# EAGLE design rc2014_8254 (EAGLE 7.6.0)
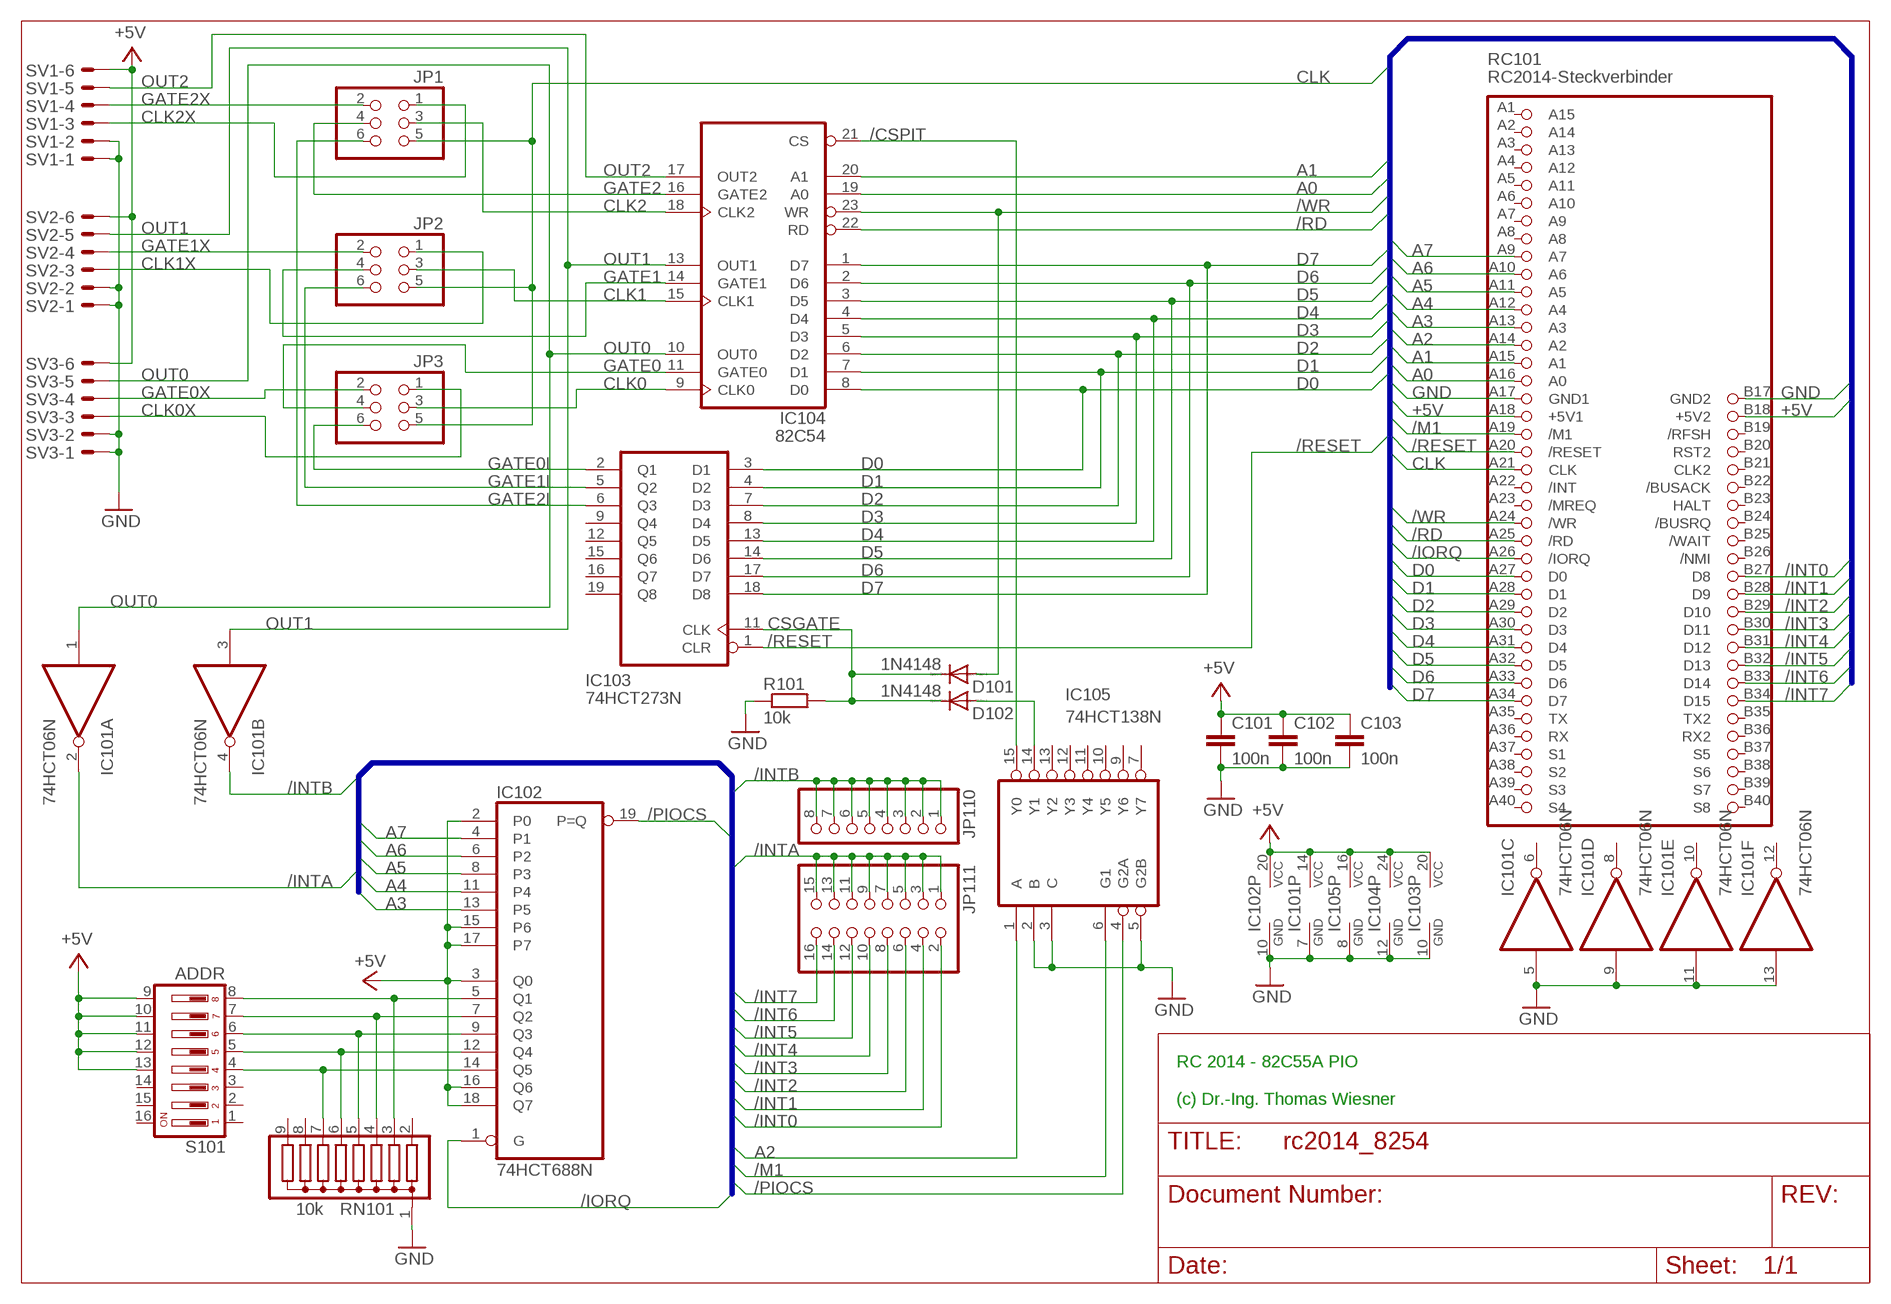
[diagram p0: schematic, sheet 1]

## Parts
C101  100n  C-EU025-025X050  [C025-025X050]
C102  100n  C-EU025-025X050  [C025-025X050]
C103  100n  C-EU025-025X050  [C025-025X050]
D101  1N4148  1N4148DO35-7  [DO35-7]
D102  1N4148  1N4148DO35-7  [DO35-7]
IC101  74HCT06N  74LS06N  [DIL14]
IC102  74HCT688N  [DIL20]
IC103  74HCT273N  [DIL20]
IC104  82C54  8253  [DIL24-6]
IC105  74HCT138N  [DIL16]
JP1  PINHD-2X3  [2X03]
JP2  PINHD-2X3  [2X03]
JP3  PINHD-2X3  [2X03]
JP110  PINHD-1X8  [1X08]
JP111  PINHD-2X8  [2X08]
R101  10k  R-EU_0207/10  [0207/10]
RC101  RC2014-Steckverbinder  RC2014STECKER  [RC2014-STECKER]
RN101  10k  G08R  [SIL9]
S101  ADDR  DS08  [DS-08]
SV1  ML6LE  [ML6L]
SV2  ML6LE  [ML6L]
SV3  ML6LE  [ML6L]

## Nets
+5V: C101.1 C102.1 C103.1 IC101.14(P:VCC) IC102.2(P0) IC102.3(Q0) IC102.15(P6) IC102.16(Q6) IC102.17(P7) IC102.18(Q7) IC102.20(VCC) IC103.20(VCC) IC104.24(VCC) IC105.16(VCC) RC101.A18(+5V1) RC101.B18(+5V2) S101.9 S101.10 S101.11 S101.12 S101.13 SV1.6 SV2.6 SV3.6
/CSPIT: IC104.21(CS) IC105.15(Y0)
/INT0: JP111.2 RC101.B27(D8)
/INT1: JP111.4 RC101.B28(D9)
/INT2: JP111.6 RC101.B29(D10)
/INT3: JP111.8 RC101.B30(D11)
/INT4: JP111.10 RC101.B31(D12)
/INT5: JP111.12 RC101.B32(D13)
/INT6: JP111.14 RC101.B33(D14)
/INT7: JP111.16 RC101.B34(D15)
/INTA: IC101.2(A:O) JP111.1 JP111.3 JP111.5 JP111.7 JP111.9 JP111.11 JP111.13 JP111.15
/INTB: IC101.4(B:O) JP110.1 JP110.2 JP110.3 JP110.4 JP110.5 JP110.6 JP110.7 JP110.8
/IORQ: IC102.1(G) RC101.A26(/IORQ)
/M1: IC105.6(G1) RC101.A19(/M1)
/PIOCS: IC102.19(P=Q) IC105.4(G2A)
/RD: IC104.22(RD) RC101.A25(/RD)
/RESET: IC103.1(CLR) RC101.A20(/RESET)
/WR: D101.A IC104.23(WR) RC101.A24(/WR)
A0: IC104.19(A0) RC101.A16(A0)
A1: IC104.20(A1) RC101.A15(A1)
A2: IC105.1(A) RC101.A14(A2)
A3: IC102.13(P5) RC101.A13(A3)
A4: IC102.11(P4) RC101.A12(A4)
A5: IC102.8(P3) RC101.A11(A5)
A6: IC102.6(P2) RC101.A10(A6)
A7: IC102.4(P1) RC101.A9(A7)
CLK: JP1.5 JP2.5 JP3.5 RC101.A21(CLK)
CLK0: IC104.9(CLK0) JP3.3
CLK0X: JP3.1 SV3.3
CLK1: IC104.15(CLK1) JP2.3
CLK1X: JP2.1 SV2.3
CLK2: IC104.18(CLK2) JP1.3
CLK2X: JP1.1 SV1.3
CSGATE: D101.C D102.C IC103.11(CLK) R101.2
D0: IC103.3(D1) IC104.8(D0) RC101.A27(D0)
D1: IC103.4(D2) IC104.7(D1) RC101.A28(D1)
D2: IC103.7(D3) IC104.6(D2) RC101.A29(D2)
D3: IC103.8(D4) IC104.5(D3) RC101.A30(D3)
D4: IC103.13(D5) IC104.4(D4) RC101.A31(D4)
D5: IC103.14(D6) IC104.3(D5) RC101.A32(D5)
D6: IC103.17(D7) IC104.2(D6) RC101.A33(D6)
D7: IC103.18(D8) IC104.1(D7) RC101.A34(D7)
GATE0: IC104.11(GATE0) JP3.4
GATE0I: IC103.2(Q1) JP3.6
GATE0X: JP3.2 SV3.4
GATE1: IC104.14(GATE1) JP2.4
GATE1I: IC103.5(Q2) JP2.6
GATE1X: JP2.2 SV2.4
GATE2: IC104.16(GATE2) JP1.4
GATE2I: IC103.6(Q3) JP1.6
GATE2X: JP1.2 SV1.4
GND: C101.2 C102.2 C103.2 IC101.5(C:I) IC101.7(P:GND) IC101.9(D:I) IC101.11(E:I) IC101.13(F:I) IC102.10(GND) IC103.10(GND) IC104.12(GND) IC105.2(B) IC105.3(C) IC105.5(G2B) IC105.8(GND) R101.1 RC101.A17(GND1) RC101.B17(GND2) RN101.1 SV1.1 SV1.2 SV2.1 SV2.2 SV3.1 SV3.2
N$1: D102.A IC105.14(Y1)
N$7: IC102.14(Q5) RN101.7 S101.4
N$8: IC102.12(Q4) RN101.6 S101.5
N$9: IC102.9(Q3) RN101.5 S101.6
N$10: IC102.7(Q2) RN101.4 S101.7
N$11: IC102.5(Q1) RN101.3 S101.8
OUT0: IC101.1(A:I) IC104.10(OUT0) SV3.5
OUT1: IC101.3(B:I) IC104.13(OUT1) SV2.5
OUT2: IC104.17(OUT2) SV1.5
Unconnected: IC101.6(C:O) IC101.8(D:O) IC101.10(E:O) IC101.12(F:O) IC103.9(Q4) IC103.12(Q5) IC103.15(Q6) IC103.16(Q7) IC103.19(Q8) IC105.7(Y7) IC105.9(Y6) IC105.10(Y5) IC105.11(Y4) IC105.12(Y3) IC105.13(Y2) RC101.A1(A15) RC101.A2(A14) RC101.A3(A13) RC101.A4(A12) RC101.A5(A11) RC101.A6(A10) RC101.A7(A9) RC101.A8 RC101.A22(/INT) RC101.A23(/MREQ) RC101.A35(TX) RC101.A36(RX) RC101.A37(S1) RC101.A38(S2) RC101.A39(S3) RC101.A40(S4) RC101.B19(/RFSH) RC101.B20(RST2) RC101.B21(CLK2) RC101.B22(/BUSACK) RC101.B23(HALT) RC101.B24(/BUSRQ) RC101.B25(/WAIT) RC101.B26(/NMI) RC101.B35(TX2) RC101.B36(RX2) RC101.B37(S5) RC101.B38(S6) RC101.B39(S7) RC101.B40(S8) RN101.2 RN101.8 RN101.9 S101.1 S101.2 S101.3 S101.14 S101.15 S101.16

## Buses
SYSTEM

## Notes on the sheet
- RC 2014 - 82C55A PIO
  
  (c) Dr.-Ing. Thomas Wiesner

## Library data of the parts
C101-C103 = rcl:C-EU: CAPACITOR, European symbol
D101 D102 = diode:1N4148: DIODE high speed (Philips)
IC101 = 74xx-eu:74*06: Hex INVERTER, open collector high-voltage output
IC102 = 74xx-eu:74*688: 8-bit MAGNITUDE/IDENTITY COMPARATOR, totem pole
IC103 = 74xx-eu:74*273: Octal D type FLIP FLOP, clear
IC104 = micro-intel:8253: MICROCOMPUTER/PERIPHERAL DEVICE; OC_FARNELL: unknown; OC_NEWARK: unknown
IC105 = 74xx-eu:74*138: 3-line to 8-line DECODER/DEMULTIPLEXER
JP1-JP3 = pinhead:PINHD-2X3: PIN HEADER
JP110 = pinhead:PINHD-1X8: PIN HEADER
JP111 = pinhead:PINHD-2X8: PIN HEADER
R101 = rcl:R-EU_: RESISTOR, European symbol
RC101 = mbc:RC2014: RC-2014-Steckverbinder Modul
RN101 = resistor-sil:G08R: SIL RESISTOR; OC_FARNELL: unknown; OC_NEWARK: unknown
S101 = switch-dil:DS08: DIL/CODE SWITCH; MPN: DS08; OC_FARNELL: unknown; OC_NEWARK: 73J0071
SV1-SV3 = con-ml:ML6LE: HARTING; OC_FARNELL: unknown; OC_NEWARK: unknown

## Board
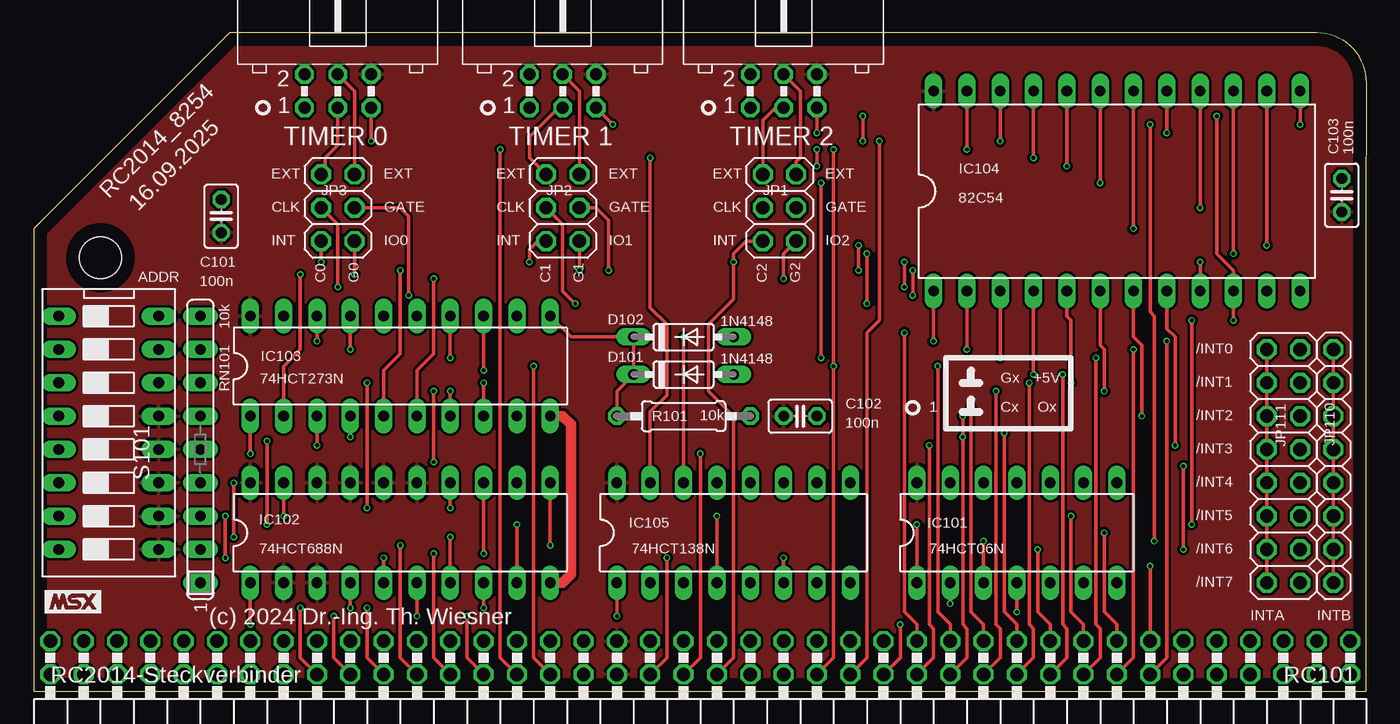
[diagram p1: board, top side]
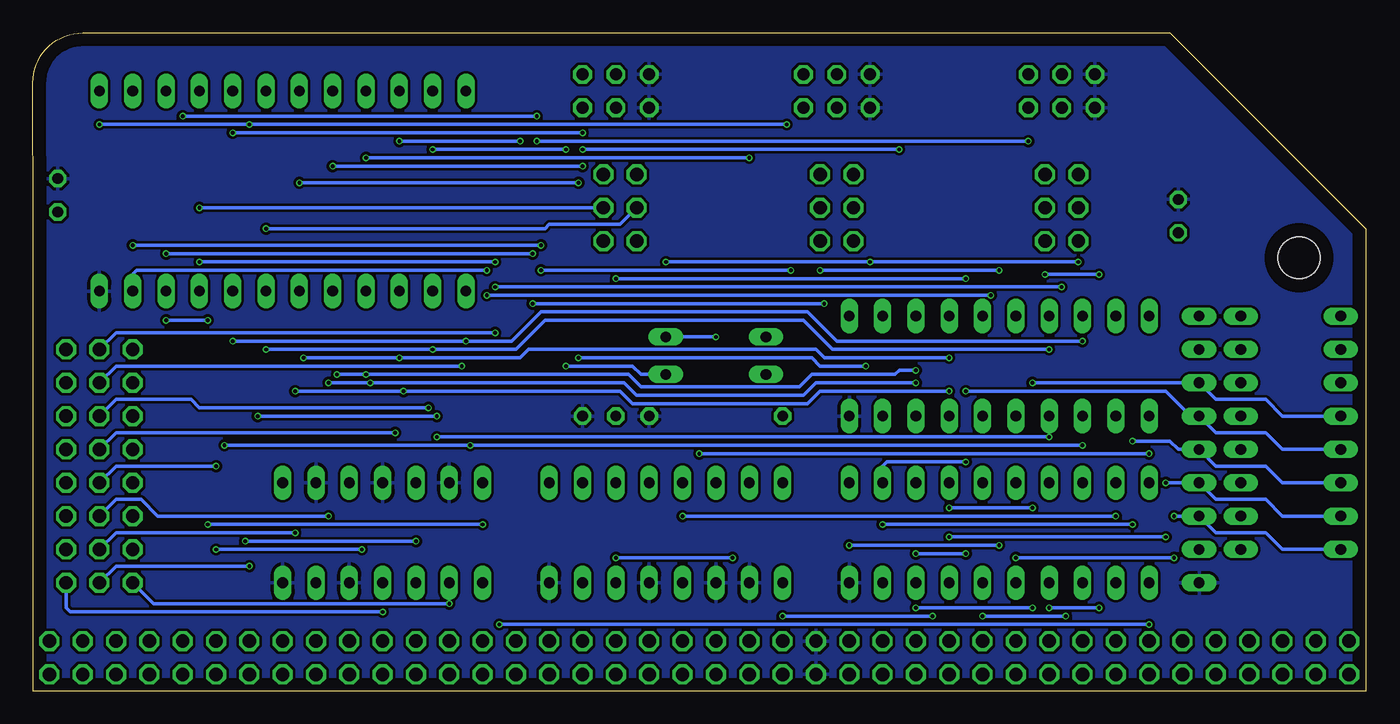
[diagram p2: board, bottom side, seen from below]

Size 101.6 x 50.16 mm. Coordinates in mm from the lower left corner, seen from the top.
Copper layers (1*16): Top 0.035mm / dielectric 1.5mm / Bottom 0.035mm
Design rules "default *": minimum track width 10mil, minimum drill 0.3mm, track to track 8mil, track to pad 4mil, pad to pad 8mil, via to via 8mil, smd to smd 8mil, copper to edge 40mil, drill to drill 8mil, minimum pad ring 10mil, minimum via ring 4mil, stop-mask expansion 4mil, vias tented up to drill 0mil, thermal gap 10mil

### Footprints (pad centres in the part's own frame; a part is rotated, then mirrored left to right if it is on the bottom)
C025-025X050 = drill 0.813 octagon: 1 -1.27,0; 2 1.27,0
DO35-7 = drill 0.813 long: A 3.81,0; C -3.81,0
DIL14 = drill 0.813 long: 1 -7.62,-3.81; 2 -5.08,-3.81; 3 -2.54,-3.81; 4 0,-3.81; 5 2.54,-3.81; 6 5.08,-3.81; 7 7.62,-3.81; 8 7.62,3.81; 9 5.08,3.81; 10 2.54,3.81; 11 0,3.81; 12 -2.54,3.81; 13 -5.08,3.81; 14 -7.62,3.81
DIL20 = drill 0.813 long: 1 -11.43,-3.81; 2 -8.89,-3.81; 3 -6.35,-3.81; 4 -3.81,-3.81; 5 -1.27,-3.81; 6 1.27,-3.81; 7 3.81,-3.81; 8 6.35,-3.81; 9 8.89,-3.81; 10 11.43,-3.81; 11 11.43,3.81; 12 8.89,3.81; 13 6.35,3.81; 14 3.81,3.81; 15 1.27,3.81; 16 -1.27,3.81; 17 -3.81,3.81; 18 -6.35,3.81; 19 -8.89,3.81; 20 -11.43,3.81
DIL24-6 = drill 0.813 long: 1 -13.97,-7.62; 2 -11.43,-7.62; 3 -8.89,-7.62; 4 -6.35,-7.62; 5 -3.81,-7.62; 6 -1.27,-7.62; 7 1.27,-7.62; 8 3.81,-7.62; 9 6.35,-7.62; 10 8.89,-7.62; 11 11.43,-7.62; 12 13.97,-7.62; 13 13.97,7.62; 14 11.43,7.62; 15 8.89,7.62; 16 6.35,7.62; 17 3.81,7.62; 18 1.27,7.62; 19 -1.27,7.62; 20 -3.81,7.62; 21 -6.35,7.62; 22 -8.89,7.62; 23 -11.43,7.62; 24 -13.97,7.62
DIL16 = drill 0.813 long: 1 -8.89,-3.81; 2 -6.35,-3.81; 3 -3.81,-3.81; 4 -1.27,-3.81; 5 1.27,-3.81; 6 3.81,-3.81; 7 6.35,-3.81; 8 8.89,-3.81; 9 8.89,3.81; 10 6.35,3.81; 11 3.81,3.81; 12 1.27,3.81; 13 -1.27,3.81; 14 -3.81,3.81; 15 -6.35,3.81; 16 -8.89,3.81
2X03 = drill 1.016 octagon: 1 -2.54,-1.27; 2 -2.54,1.27; 3 0,-1.27; 4 0,1.27; 5 2.54,-1.27; 6 2.54,1.27
1X08 = drill 1.016 octagon: 1 -8.89,0; 2 -6.35,0; 3 -3.81,0; 4 -1.27,0; 5 1.27,0; 6 3.81,0; 7 6.35,0; 8 8.89,0
2X08 = drill 1.016 octagon: 1 -8.89,-1.27; 2 -8.89,1.27; 3 -6.35,-1.27; 4 -6.35,1.27; 5 -3.81,-1.27; 6 -3.81,1.27; 7 -1.27,-1.27; 8 -1.27,1.27; 9 1.27,-1.27; 10 1.27,1.27; 11 3.81,-1.27; 12 3.81,1.27; 13 6.35,-1.27; 14 6.35,1.27; 15 8.89,-1.27; 16 8.89,1.27
0207/10 = drill 0.813 octagon: 1 -5.08,0; 2 5.08,0
RC2014-STECKER = drill 1.016 octagon: A1 -49.53,1.27; A2 -46.99,1.27; A3 -44.45,1.27; A4 -41.91,1.27; A5 -39.37,1.27; A6 -36.83,1.27; A7 -34.29,1.27; A8 -31.75,1.27; A9 -29.21,1.27; A10 -26.67,1.27; A11 -24.13,1.27; A12 -21.59,1.27; A13 -19.05,1.27; A14 -16.51,1.27; A15 -13.97,1.27; A16 -11.43,1.27; A17 -8.89,1.27; A18 -6.35,1.27; A19 -3.81,1.27; A20 -1.27,1.27; A21 1.27,1.27; A22 3.81,1.27; A23 6.35,1.27; A24 8.89,1.27; A25 11.43,1.27; A26 13.97,1.27; A27 16.51,1.27; A28 19.05,1.27; A29 21.59,1.27; A30 24.13,1.27; A31 26.67,1.27; A32 29.21,1.27; A33 31.75,1.27; A34 34.29,1.27; A35 36.83,1.27; A36 39.37,1.27; A37 41.91,1.27; A38 44.45,1.27; A39 46.99,1.27; A40 49.53,1.27; B1 -49.53,3.81; B2 -46.99,3.81; B3 -44.45,3.81; B4 -41.91,3.81; B5 -39.37,3.81; B6 -36.83,3.81; B7 -34.29,3.81; B8 -31.75,3.81; B9 -29.21,3.81; B10 -26.67,3.81; B11 -24.13,3.81; B12 -21.59,3.81; B13 -19.05,3.81; B14 -16.51,3.81; B15 -13.97,3.81; B16 -11.43,3.81; B17 -8.89,3.81; B18 -6.35,3.81; B19 -3.81,3.81; B20 -1.27,3.81; B21 1.27,3.81; B22 3.81,3.81; B23 6.35,3.81; B24 8.89,3.81; B25 11.43,3.81; B26 13.97,3.81; B27 16.51,3.81; B28 19.05,3.81; B29 21.59,3.81; B30 24.13,3.81; B31 26.67,3.81; B32 29.21,3.81; B33 31.75,3.81; B34 34.29,3.81; B35 36.83,3.81; B36 39.37,3.81; B37 41.91,3.81; B38 44.45,3.81; B39 46.99,3.81; B40 49.53,3.81 | hole 3.2: -45.72,33.02
SIL9 = drill 0.813 long: 1 -10.16,0; 2 -7.62,0; 3 -5.08,0; 4 -2.54,0; 5 0,0; 6 2.54,0; 7 5.08,0; 8 7.62,0; 9 10.16,0
DS-08 = drill 0.813 long: 1 -8.89,-3.81; 2 -6.35,-3.81; 3 -3.81,-3.81; 4 -1.27,-3.81; 5 1.27,-3.81; 6 3.81,-3.81; 7 6.35,-3.81; 8 8.89,-3.81; 9 8.89,3.81; 10 6.35,3.81; 11 3.81,3.81; 12 1.27,3.81; 13 -1.27,3.81; 14 -3.81,3.81; 15 -6.35,3.81; 16 -8.89,3.81
ML6L = drill 0.914 octagon: 1 -2.54,-1.27; 2 -2.54,1.27; 3 0,-1.27; 4 0,1.27; 5 2.54,-1.27; 6 2.54,1.27

### Placement (x,y rotation side)
C101  14.29,36.2 90 top
C102  58.42,20.95 0 top
C103  99.69,37.78 90 top
D101  49.53,24.13 0 top
D102  49.53,26.99 0 top
IC101  74.93,12.06 0 top
IC102  27.94,12.06 0 top
IC103  27.94,24.77 0 top
IC104  82.55,38.1 0 top
IC105  53.34,12.06 0 top
JP1  56.83,36.83 270 top
JP2  40.32,36.83 270 top
JP3  23.18,36.83 270 top
JP110  99.06,17.14 270 top
JP111  95.25,17.14 270 top
R101  49.53,20.95 180 top
RC101  50.8,0 0 top
RN101  12.7,18.41 90 top
S101  5.71,19.68 270 top
SV1  57.15,45.72 0 top
SV2  40.32,45.72 0 top
SV3  23.18,45.72 0 top

### Tracks (layer width: path | path; a pad name or v marks a point on that pad's centre or on a via)
+5V
  pour Top: 0,0 0,35.24 14.92,50.16 101.6,50.16 101.6,0
/CSPIT  (via drill 0.3)
  Top 0.254: IC104.21 v76.2,40.64 | v46.99,40.64 46.99,29.21 48.26,27.94 48.26,22.54 46.99,21.27 IC105.15
  Bottom 0.254: v76.2,40.64 v46.99,40.64
/INT0  (via drill 0.3)
  Top 0.254: v66.36,27.3 66.36,6.03 67.31,5.08 RC101.B27
  Bottom 0.254: JP111.2 95.25,27.3 v66.36,27.3
/INT1  (via drill 0.3)
  Top 0.254: RC101.B28 69.85,5.08 68.9,6.03 v68.9,24.77
  Bottom 0.254: v68.9,24.77 95.25,24.77 JP111.4
/INT2  (via drill 0.3)
  Top 0.254: v71.44,21.59 71.44,6.03 72.39,5.08 RC101.B29
  Bottom 0.254: JP111.6 95.25,22.23 89.53,22.23 88.9,21.59 v71.44,21.59
/INT3  (via drill 0.3)
  Top 0.254: v73.98,19.68 73.98,6.03 74.93,5.08 RC101.B30
  Bottom 0.254: JP111.8 95.25,19.68 v73.98,19.68
/INT4  (via drill 0.3)
  Top 0.254: v87.63,17.14 v87.63,10.79 | v76.52,10.79 76.52,6.03 77.47,5.08 RC101.B31
  Bottom 0.254: JP111.10 95.25,17.14 v87.63,17.14 | v87.63,10.79 v76.52,10.79
/INT5  (via drill 0.3)
  Top 0.254: RC101.B32 80.01,5.08 79.06,6.03 v79.06,13.34
  Bottom 0.254: v79.06,13.34 92.08,13.34 93.34,14.61 95.25,14.61 JP111.12
/INT6  (via drill 0.3)
  Top 0.254: v81.6,12.06 81.6,6.03 82.55,5.08 RC101.B33
  Bottom 0.254: JP111.14 95.25,12.06 v81.6,12.06
/INT7  (via drill 0.3)
  Top 0.254: RC101.B34 v85.09,9.53
  Bottom 0.254: v85.09,9.53 95.25,9.53 JP111.16
/INTA  (via drill 0.3)
  Top 0.254: JP111.1 JP111.3 JP111.5 JP111.7 JP111.9 JP111.11 JP111.13 JP111.15 | v69.85,6.67 IC101.2
  Bottom 0.254: JP111.15 92.39,6.67 v69.85,6.67
/INTB  (via drill 0.3)
  Top 0.254: JP110.8 JP110.7 JP110.6 JP110.5 JP110.4 JP110.3 JP110.2 JP110.1 | v74.93,6.03 IC101.4
  Bottom 0.254: JP110.8 99.06,6.35 98.74,6.03 v74.93,6.03
/IORQ  (via drill 0.3)
  Top 0.254: RC101.A26 66.04,2.54 v66.04,5.08 | v16.51,5.08 IC102.1
  Bottom 0.254: v66.04,5.08 v16.51,5.08
/M1  (via drill 0.3)
  Top 0.254: RC101.A19 48.26,2.54 v48.26,10.16 | v57.15,10.16 IC105.6
  Bottom 0.254: v48.26,10.16 v57.15,10.16
/PIOCS  (via drill 0.3)
  Top 0.254: IC105.4 v52.07,13.34 | v19.05,13.34 IC102.19
  Bottom 0.254: v52.07,13.34 v19.05,13.34
/RD  (via drill 0.3)
  Top 0.254: RC101.A25 63.5,2.54 63.5,27.3 64.45,28.26 v64.45,41.91 | v73.66,41.91 IC104.22
  Bottom 0.254: v64.45,41.91 v73.66,41.91
/RESET  (via drill 0.3)
  Top 0.254: RC101.A20 50.8,2.54 v50.8,18.1 | IC103.1 v16.51,18.1
  Bottom 0.254: v50.8,18.1 v16.51,18.1
/WR  (via drill 0.3)
  Top 0.254: RC101.A24 60.96,2.54 v60.96,24.77 v60.96,41.27 | v71.12,41.27 IC104.23
  Bottom 0.254: v60.96,41.27 v71.12,41.27 | D101.A 55.24,24.13 55.88,24.77 v60.96,24.77
A0  (via drill 0.3)
  Top 0.254: RC101.A16 38.1,2.54 v38.1,24.77 | v60.01,25.4 v60.01,38.73 | v81.28,38.73 IC104.19
  Bottom 0.254: v38.1,24.77 41.59,24.77 42.23,25.4 v60.01,25.4 | v60.01,38.73 v81.28,38.73
A1  (via drill 0.3)
  Top 0.254: IC104.20 v78.74,40.01 | v59.69,40.01 v59.69,41.27 | v35.56,41.27 35.56,2.54 RC101.A15
  Bottom 0.254: v78.74,40.01 v59.69,40.01 | v59.69,41.27 v35.56,41.27
A2  (via drill 0.3)
  Top 0.254: RC101.A14 33.02,2.54 v33.02,5.71 | v44.45,5.71 IC105.1
  Bottom 0.254: v33.02,5.71 v44.45,5.71
A3  (via drill 0.3)
  Top 0.254: RC101.A13 30.48,2.54 v30.48,10.48 | v34.29,10.48 IC102.13
  Bottom 0.254: v30.48,10.48 v34.29,10.48
A4  (via drill 0.3)
  Top 0.254: RC101.A12 27.94,2.54 v27.94,11.11 | v39.37,11.11 IC102.11
  Bottom 0.254: v27.94,11.11 v39.37,11.11
A5  (via drill 0.3)
  Top 0.254: RC101.A11 25.4,2.54 v25.4,6.35 | v34.29,6.35 IC102.8
  Bottom 0.254: v25.4,6.35 v34.29,6.35
A6  (via drill 0.3)
  Top 0.254: RC101.A10 22.86,2.54 v22.86,5.71 | v29.21,5.71 IC102.6
  Bottom 0.254: v22.86,5.71 v29.21,5.71
A7  (via drill 0.3)
  Top 0.254: RC101.A9 20.32,2.54 v20.32,6.35 | v24.13,6.35 IC102.4
  Bottom 0.254: v20.32,6.35 v24.13,6.35
CLK  (via drill 0.3)
  Top 0.254: RC101.A21 53.34,2.54 53.34,20.95 51.44,22.86 51.44,27.94 53.34,29.84 v53.34,32.7 53.34,33.34 54.29,34.29 JP1.5 | JP3.5 v21.91,32.7 | JP2.5 38.42,34.29 37.78,33.66 v37.78,32.7
  Bottom 0.254: v21.91,32.7 v37.78,32.7 v53.34,32.7
CLK0  (via drill 0.3)
  Top 0.254: v23.18,30.8 23.18,35.56 JP3.3 | v66.36,30.8 v66.36,32.7 | v88.9,32.7 IC104.9
  Bottom 0.254: v23.18,30.8 v66.36,30.8 | v66.36,32.7 v88.9,32.7
CLK0X
  Top 0.254: SV3.3 23.18,41.59 22.23,40.64 22.23,39.69 JP3.1
CLK1  (via drill 0.3)
  Top 0.254: JP2.3 40.32,35.56 40.32,30.48 v41.27,29.53 | v63.5,29.53 v63.5,33.34 | v91.44,33.34 IC104.15
  Bottom 0.254: v41.27,29.53 v63.5,29.53 | v63.5,33.34 v91.44,33.34
CLK1X
  Top 0.254: SV2.3 40.01,44.45 37.78,42.23 37.78,40.64 JP2.1
CLK2  (via drill 0.3)
  Top 0.254: v83.82,35.24 IC104.18
  Bottom 0.254: JP1.3 56.83,35.56 62.23,35.56 62.55,35.24 v83.82,35.24
CLK2X
  Top 0.254: SV1.3 56.52,44.45 55.56,43.5 JP1.1
CSGATE
  Top 0.254: R101.2 44.45,22.86 D101.C D102.C 40.96,26.99 IC103.11
D0  (via drill 0.3)
  Top 0.254: RC101.A27 68.58,2.54 68.58,4.76 68.26,5.08 v68.26,18.73 | v87,18.73 87,26.99 86.36,27.62 IC104.8 | IC103.3 v21.59,18.73
  Bottom 0.254: v87,18.73 v68.26,18.73 v21.59,18.73
D1  (via drill 0.3)
  Top 0.254: RC101.A28 71.12,2.54 71.12,4.76 70.8,5.08 v70.8,19.37 v70.8,20.95 | v84.45,20.95 84.45,26.35 83.82,26.99 IC104.7 | IC103.4 v24.13,19.37
  Bottom 0.254: v70.8,20.95 v84.45,20.95 | v24.13,19.37 v70.8,19.37
D2  (via drill 0.3)
  Top 0.254: RC101.A29 73.66,2.54 73.66,4.76 73.34,5.08 v73.34,22.86 | v81.6,22.86 81.6,26.04 81.28,26.35 IC104.6 | v31.75,22.86 IC103.7
  Bottom 0.254: v81.6,22.86 v73.34,22.86 57.47,22.86 56.83,22.86 55.88,21.91 42.55,21.91 41.59,22.86 v31.75,22.86
D3  (via drill 0.3)
  Top 0.254: RC101.A30 76.2,2.54 76.2,4.76 75.88,5.08 v75.88,23.5 | v79.06,23.5 79.06,28.26 78.74,28.57 IC104.5 | v34.29,23.5 IC103.8
  Bottom 0.254: v79.06,23.5 v75.88,23.5 56.52,23.5 55.56,22.54 42.86,22.54 41.91,23.5 v34.29,23.5
D4  (via drill 0.3)
  Top 0.254: RC101.A31 78.74,2.54 78.74,4.76 78.42,5.08 v78.42,24.13 | v76.2,24.13 IC104.4 | IC103.13 v34.29,24.45
  Bottom 0.254: v78.42,24.13 v76.2,24.13 56.2,24.13 55.24,23.18 43.18,23.18 42.23,24.13 35.88,24.13 35.56,24.45 v34.29,24.45
D5  (via drill 0.3)
  Top 0.254: RC101.A32 81.28,2.54 81.28,4.76 80.96,5.08 v80.96,25.4 | v73.66,25.4 IC104.3 | IC103.14 v31.75,25.4
  Bottom 0.254: v80.96,25.4 v73.66,25.4 64.45,25.4 63.82,26.04 41.91,26.04 41.27,25.4 v31.75,25.4
D6  (via drill 0.3)
  Top 0.254: RC101.A33 83.82,2.54 v83.82,26.04 | v71.12,26.04 IC104.2 | IC103.17 v24.13,26.04
  Bottom 0.254: v83.82,26.04 v71.12,26.04 64.77,26.04 62.55,28.26 42.86,28.26 40.64,26.04 v24.13,26.04
D7  (via drill 0.3)
  Top 0.254: RC101.A34 86.36,2.54 v86.36,26.67 | v68.58,26.67 IC104.1 | IC103.18 v21.59,26.67
  Bottom 0.254: v86.36,26.67 v68.58,26.67 65.09,26.67 62.87,28.89 42.55,28.89 40.32,26.67 v21.59,26.67
GATE0  (via drill 0.3)
  Top 0.254: v28.57,30.16 28.57,36.2 27.94,36.83 JP3.4 | v66.99,30.16 v66.99,32.07
  Bottom 0.254: v28.57,30.16 v66.99,30.16 | v66.99,32.07 93.66,32.07 93.98,31.75 IC104.11
GATE0I  (via drill 0.3)
  Top 0.254: IC103.2 19.05,24.77 20.32,26.04 v20.32,31.75 | v24.45,31.75 JP3.6
  Bottom 0.254: v20.32,31.75 v24.45,31.75
GATE0X
  Top 0.254: SV3.4 24.45,45.72 JP3.2
GATE1  (via drill 0.3)
  Top 0.254: v43.81,32.07 43.81,35.88 42.86,36.83 JP2.4 | v62.87,32.07 v62.87,33.97 | v93.98,33.97 IC104.14
  Bottom 0.254: v43.81,32.07 v62.87,32.07 | v62.87,33.97 v93.98,33.97
GATE1I  (via drill 0.3)
  Top 0.254: IC103.5 26.67,24.45 27.94,25.72 v27.94,32.07 | JP2.6 v41.59,32.07
  Bottom 0.254: v27.94,32.07 v41.59,32.07
GATE1X
  Top 0.254: SV2.4 41.59,45.72 JP2.2
GATE2  (via drill 0.3)
  Top 0.254: v88.9,36.83 IC104.16
  Bottom 0.254: JP1.4 v88.9,36.83
GATE2I  (via drill 0.3)
  Top 0.254: IC103.6 29.21,24.45 30.48,25.72 v30.48,31.43 | v57.15,31.43 57.15,33.34 JP1.6
  Bottom 0.254: v30.48,31.43 v57.15,31.43
GATE2X
  Top 0.254: SV1.4 58.42,45.72 58.42,40.64 58.1,40.32 JP1.2
GND
  Top 0.813: IC103.10 40.32,20.95 40.96,20.32 40.96,8.89 40.32,8.26 IC102.10
  pour Bottom: 0,0 0,35.24 14.92,50.16 101.6,50.16 101.6,0
N$1  (via drill 0.3)
  Top 0.254: IC105.14 v49.53,26.99
  Bottom 0.254: v49.53,26.99 D102.A
N$7  (via drill 0.3)
  Top 0.254: v25.4,23.5 v25.4,13.97 | v31.75,13.97 IC102.14
  Bottom 0.254: S101.4 6.35,20.95 7.62,22.23 11.43,22.23 RN101.7 v25.4,23.5 | v25.4,13.97 v31.75,13.97
N$8  (via drill 0.3)
  Top 0.254: v30.48,22.86 v30.48,17.46
  Bottom 0.254: S101.5 6.35,18.41 7.62,19.68 11.43,19.68 RN101.6 13.34,20.95 15.24,22.86 v30.48,22.86 | v30.48,17.46 36.51,17.46 36.83,17.14 IC102.12
N$9  (via drill 0.3)
  Top 0.254: IC102.9 v36.83,12.7 | v17.78,12.7 v17.78,19.05
  Bottom 0.254: S101.6 6.35,15.88 7.62,17.14 11.43,17.14 RN101.5 14.29,18.41 14.92,19.05 v17.78,19.05 | v36.83,12.7 v17.78,12.7
N$10  (via drill 0.3)
  Top 0.254: IC102.7 v31.75,11.75 | v15.24,11.75 v15.24,15.88
  Bottom 0.254: S101.7 6.35,13.34 7.62,14.61 11.43,14.61 RN101.4 v15.24,15.88 | v31.75,11.75 v15.24,11.75
N$11  (via drill 0.3)
  Top 0.254: IC102.5 v26.67,10.16 | v14.61,10.16 v14.61,13.34
  Bottom 0.254: S101.8 6.35,10.79 7.62,12.06 11.43,12.06 RN101.3 v14.61,13.34 | v26.67,10.16 v14.61,10.16
OUT0  (via drill 0.3)
  Top 0.254: SV3.5 v25.72,41.91 | v63.18,41.91 v63.18,43.81 | v90.17,43.81 90.17,33.34 91.44,32.07 IC104.10 v91.44,28.26 | IC101.1 v67.31,12.7 | v88.27,12.7 v88.27,28.26
  Bottom 0.254: v25.72,41.91 v63.18,41.91 | v63.18,43.81 v90.17,43.81 | v67.31,12.7 v88.27,12.7 | v88.27,28.26 v91.44,28.26
OUT1  (via drill 0.3)
  Top 0.254: v96.52,43.18 IC104.13 | IC101.3 v72.39,11.43 | v85.41,11.43 85.41,28.57 85.09,28.89 v85.09,43.18 | SV2.5 v44.13,43.18
  Bottom 0.254: v44.13,43.18 v85.09,43.18 v96.52,43.18 | v72.39,11.43 v85.41,11.43
OUT2  (via drill 0.3)
  Top 0.254: v86.36,42.55 IC104.17 | v59.69,42.55 SV1.5
  Bottom 0.254: v59.69,42.55 v86.36,42.55

### Text on the board
tNames: TIMER 0 | TIMER 1 | TIMER 2 | EXT | EXT | EXT | EXT | EXT | EXT | RC2014_8254 | 16.09.2025 | CLK | GATE | CLK | GATE | CLK | GATE | INT | IO0 | INT | IO1 | INT | IO2 | C0 | G0 | C1 | G1 | C2 | G2 | /INT0 | Gx | +5V | /INT1 | 1 | Cx | Ox | /INT2 | /INT3 | /INT4 | /INT5 | /INT6 | /INT7 | (c) 2024 Dr.-Ing. Th. Wiesner | INTA | INTB